# EasyEDA Pro project LisaFPGA Rev 2 EasyEDA Project.epro, schematic LisaFPGA Schematic, sheets 2 to 3 of 8

## Sheets
2 FPGA Programming: Create Date: 2025-10-15; Page Name: FPGA Programming; Update Date: 2026-01-05
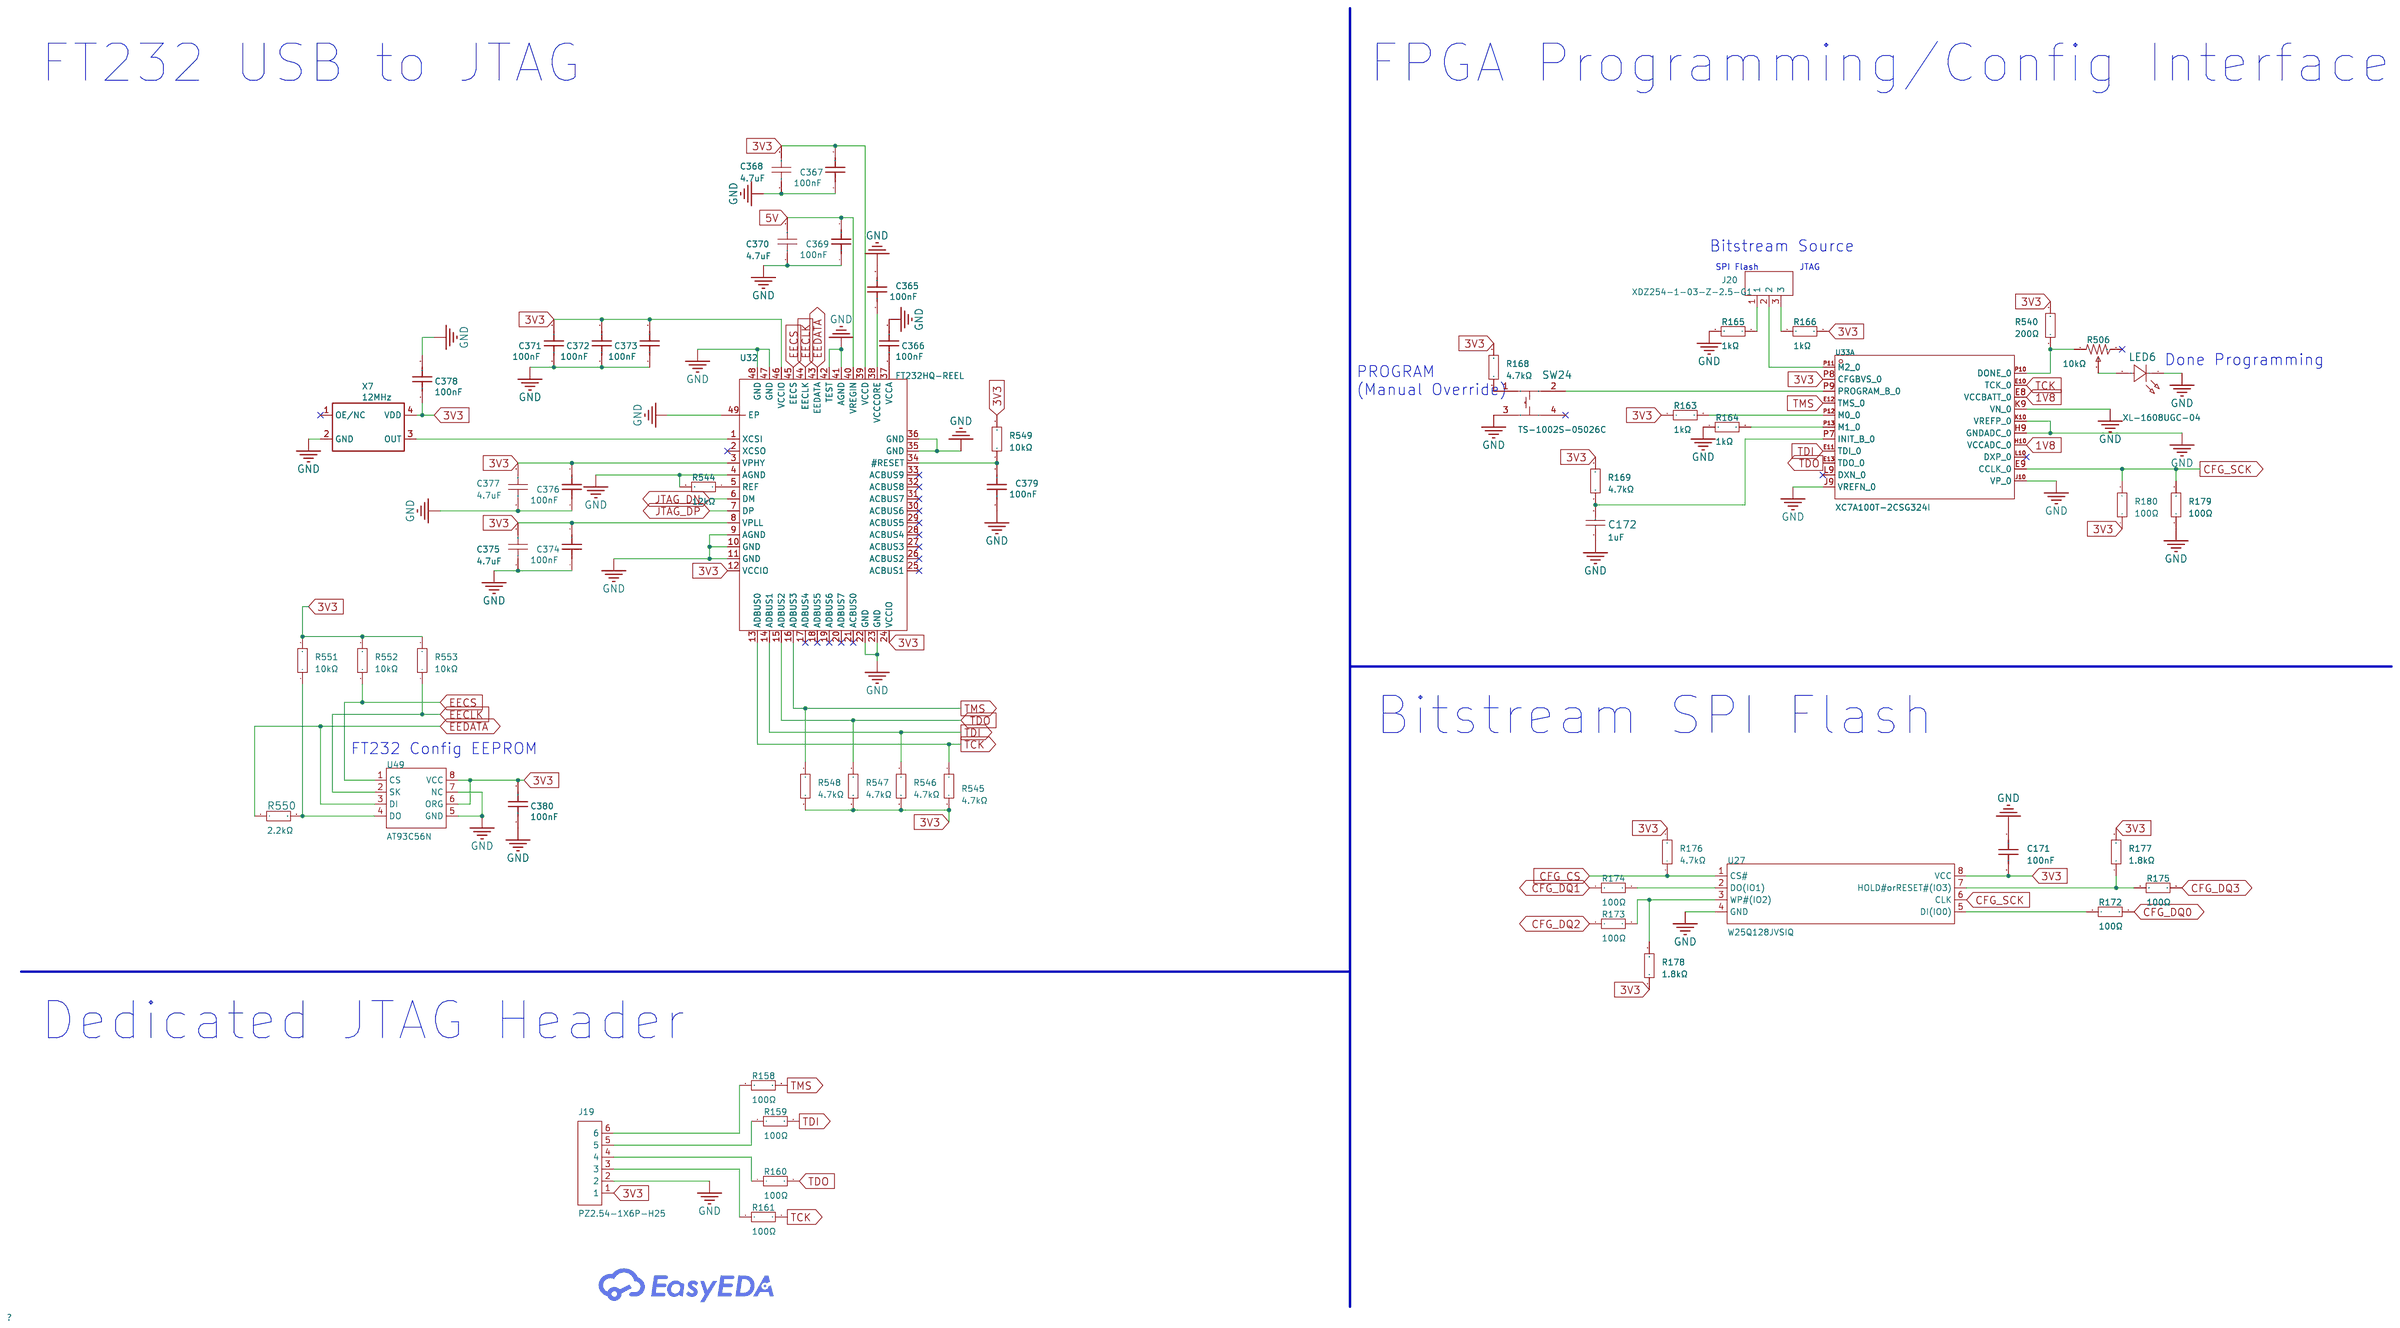
[diagram p2: FPGA Programming]
3 ProFile Interface and SRAM: Create Date: 2025-10-24; Page Name: ProFile Interface and SRAM; Update Date: 2026-01-07
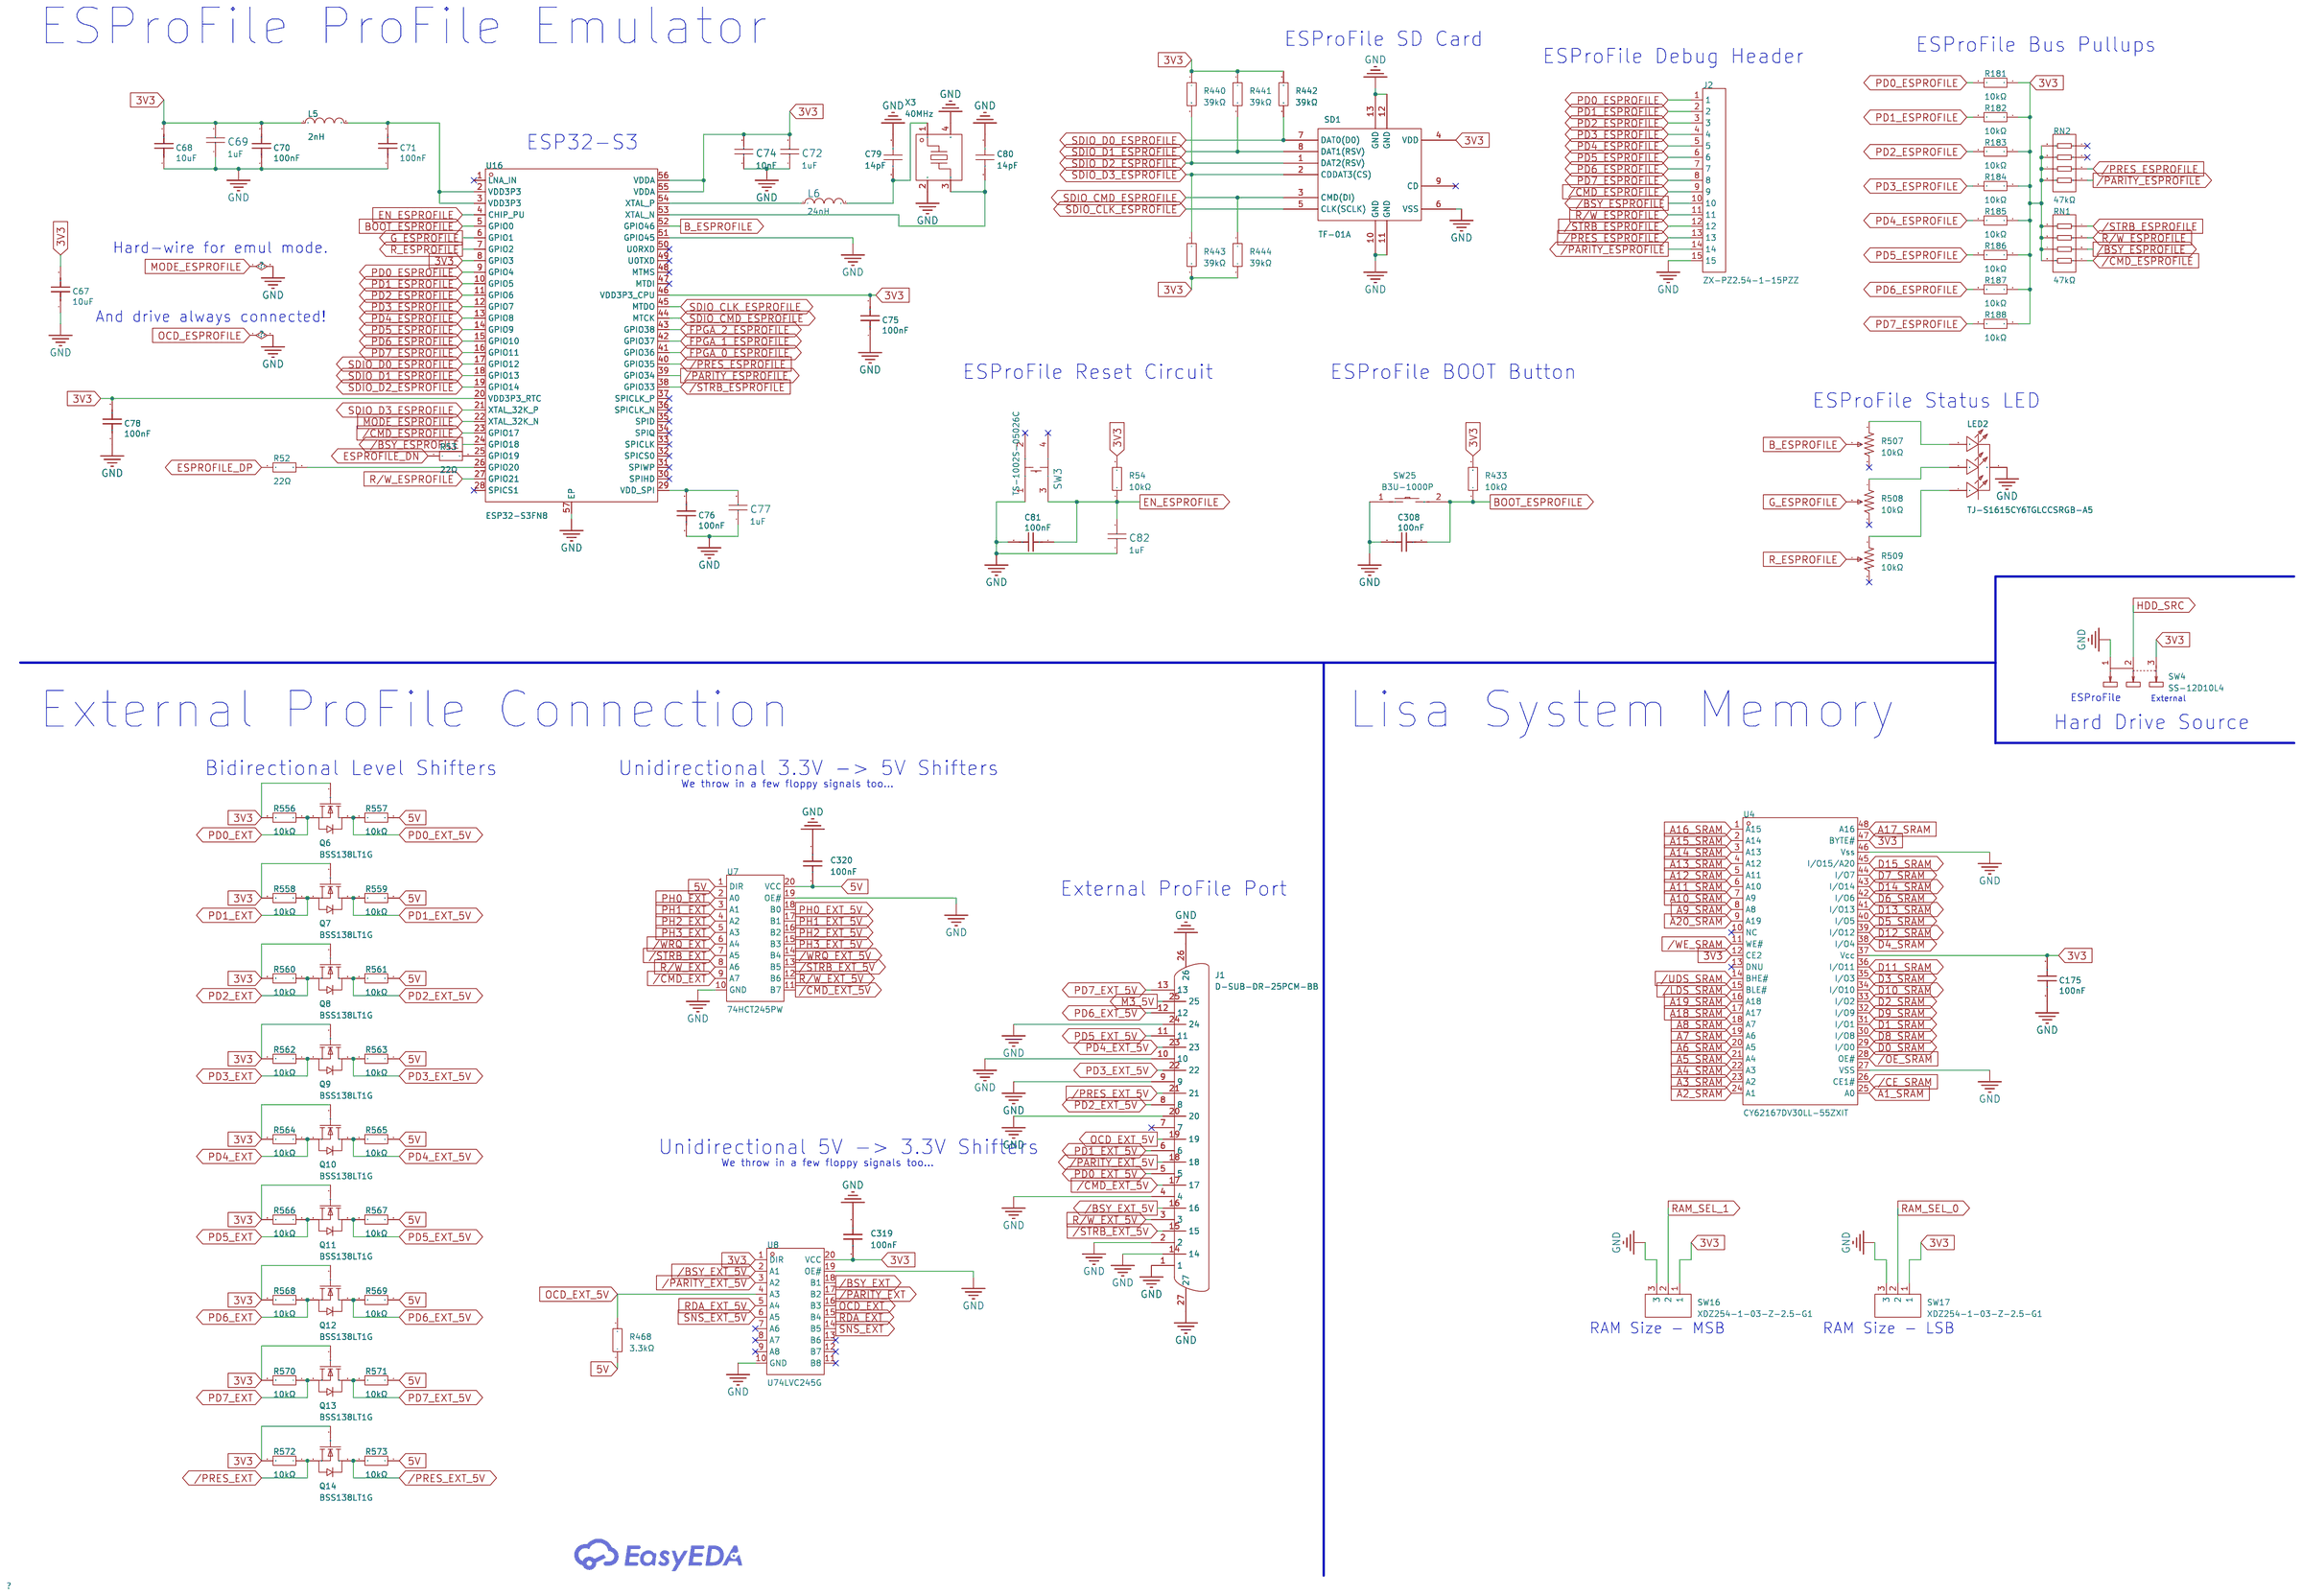
[diagram p3: ProFile Interface and SRAM]

## Parts
sheet FPGA Programming
C171  100nF  [C0402]
C172  1uF  [C0402]
C365  100nF  [C0402]
C366  100nF  [C0402]
C367  100nF  [C0402]
C368  4.7uF  [C0603]
C369  100nF  [C0402]
C370  4.7uF  [C0603]
C371  100nF  [C0402]
C372  100nF  [C0402]
C373  100nF  [C0402]
C374  100nF  [C0402]
C375  4.7uF  [C0603]
C376  100nF  [C0402]
C377  4.7uF  [C0603]
C378  100nF  [C0402]
C379  100nF  [C0402]
C380  100nF  [C0402]
J19  PZ2.54-1X6P-H25  [HDR-TH_6P-P2.54-V-M]
J20  XDZ254-1-03-Z-2.5-G1  [HDR-TH_3P-P2.54-V-M-1]
LED6  XL-1608UGC-04  [LED0603-RD_GREEN]
R158  100Ω  [R0402]
R159  100Ω  [R0402]
R160  100Ω  [R0402]
R161  100Ω  [R0402]
R163  1kΩ  [R0402]
R164  1kΩ  [R0402]
R165  1kΩ  [R0402]
R166  1kΩ  [R0402]
R168  4.7kΩ  [R0402]
R169  4.7kΩ  [R0402]
R172  100Ω  [R0402]
R173  100Ω  [R0402]
R174  100Ω  [R0402]
R175  100Ω  [R0402]
R176  4.7kΩ  [R0402]
R177  1.8kΩ  [R0402]
R178  1.8kΩ  [R0402]
R179  100Ω  [R0402]
R180  100Ω  [R0402]
R506  10kΩ  [RES-ADJ-SMD_3P-L3.0-W3.8-P1.75-BR]
R540  200Ω  [R0402]
R544  12kΩ  [R0603]
R545  4.7kΩ  [R0402]
R546  4.7kΩ  [R0402]
R547  4.7kΩ  [R0402]
R548  4.7kΩ  [R0402]
R549  10kΩ  [R0402]
R550  2.2kΩ  [R0402]
R551  10kΩ  [R0402]
R552  10kΩ  [R0402]
R553  10kΩ  [R0402]
SW24  TS-1002S-05026C  [KEY-SMD_4P-L6.0-W6.0-P4.50-LS9.0]
U27  W25Q128JVSIQ  [SOIC-8_L5.3-W5.3-P1.27-LS8.0-BL]
U32  FT232HQ-REEL  [QFN-48_L8.0-W8.0-P0.50-BL-EP]
U33  XC7A100T-2CSG324I  [BGA-324_L15.0-W15.0-R18-C18-P0.8-TL]  (sections 1,2,3,4)
U49  AT93C56N  [DIP-8_L9.3-W6.4-P2.54-LS7.6-BL]
X7  12MHz  [OSC-SMD_4P-L3.2-W2.5-BL]
sheet ProFile Interface and SRAM
C67  10uF  [C0603]
C68  10uF  [C0603]
C69  1uF  [C0402]
C70  100nF  [C0402]
C71  100nF  [C0402]
C72  1uF  [C0402]
C74  10nF  [C0402]
C75  100nF  [C0402]
C76  100nF  [C0402]
C77  1uF  [C0402]
C78  100nF  [C0402]
C79  14pF  [C0402]
C80  14pF  [C0402]
C81  100nF  [C0402]
C82  1uF  [C0402]
C175  100nF  [C0402]
C308  100nF  [C0402]
C319  100nF  [C0402]
C320  100nF  [C0402]
J1  D-SUB-DR-25PCM-BB  [DB25-TH_D-SUB-DR-25PCM-BB]
J2  ZX-PZ2.54-1-15PZZ  [HDR-TH_15P-P2.54-V-M]
L5  2nH  [L0402-RD]
L6  24nH  [IND-SMD_L1.6-W0.8]
LED2  TJ-S1615CY6TGLCCSRGB-A5  [LED-ARRAY-SMD_4P-L1.6-W1.5-BL-FD]
Q6  BSS138LT1G  [SOT-23-3_L2.9-W1.6-P1.90-LS2.8-BR]
Q7  BSS138LT1G  [SOT-23-3_L2.9-W1.6-P1.90-LS2.8-BR]
Q8  BSS138LT1G  [SOT-23-3_L2.9-W1.6-P1.90-LS2.8-BR]
Q9  BSS138LT1G  [SOT-23-3_L2.9-W1.6-P1.90-LS2.8-BR]
Q10  BSS138LT1G  [SOT-23-3_L2.9-W1.6-P1.90-LS2.8-BR]
Q11  BSS138LT1G  [SOT-23-3_L2.9-W1.6-P1.90-LS2.8-BR]
Q12  BSS138LT1G  [SOT-23-3_L2.9-W1.6-P1.90-LS2.8-BR]
Q13  BSS138LT1G  [SOT-23-3_L2.9-W1.6-P1.90-LS2.8-BR]
Q14  BSS138LT1G  [SOT-23-3_L2.9-W1.6-P1.90-LS2.8-BR]
R52  22Ω  [R0402]
R53  22Ω  [R0402]
R54  10kΩ  [R0402]
R181  10kΩ  [R0402]
R182  10kΩ  [R0402]
R183  10kΩ  [R0402]
R184  10kΩ  [R0402]
R185  10kΩ  [R0402]
R186  10kΩ  [R0402]
R187  10kΩ  [R0402]
R188  10kΩ  [R0402]
R433  10kΩ  [R0402]
R440  39kΩ  [R0402]
R441  39kΩ  [R0402]
R442  39kΩ  [R0402]
R443  39kΩ  [R0402]
R444  39kΩ  [R0402]
R468  3.3kΩ  [R0402]
R507  10kΩ  [RES-ADJ-SMD_3P-L3.0-W3.8-P1.75-BR]
R508  10kΩ  [RES-ADJ-SMD_3P-L3.0-W3.8-P1.75-BR]
R509  10kΩ  [RES-ADJ-SMD_3P-L3.0-W3.8-P1.75-BR]
R556  10kΩ  [R0402]
R557  10kΩ  [R0402]
R558  10kΩ  [R0402]
R559  10kΩ  [R0402]
R560  10kΩ  [R0402]
R561  10kΩ  [R0402]
R562  10kΩ  [R0402]
R563  10kΩ  [R0402]
R564  10kΩ  [R0402]
R565  10kΩ  [R0402]
R566  10kΩ  [R0402]
R567  10kΩ  [R0402]
R568  10kΩ  [R0402]
R569  10kΩ  [R0402]
R570  10kΩ  [R0402]
R571  10kΩ  [R0402]
R572  10kΩ  [R0402]
R573  10kΩ  [R0402]
RN1  47kΩ  [RES-ARRAY-SMD_0603-8P-L3.2-W1.6-BL]
RN2  47kΩ  [RES-ARRAY-SMD_0603-8P-L3.2-W1.6-BL]
SD1  TF-01A  [TF-SMD_TF-01A]
SW3  TS-1002S-05026C  [KEY-SMD_4P-L6.0-W6.0-P4.50-LS9.0]
SW4  SS-12D10L4  [SW-TH_SS-12D10L3]
SW16  XDZ254-1-03-Z-2.5-G1  [HDR-TH_3P-P2.54-V-M-1]
SW17  XDZ254-1-03-Z-2.5-G1  [HDR-TH_3P-P2.54-V-M-1]
SW25  B3U-1000P  [KEY-SMD_B3U-1000PM]
U4  CY62167DV30LL-55ZXIT  [TSOP-48_L18.4-W12.0-P0.50-LS20.0-TL]
U7  74HCT245PW  [TSSOP-20_L6.5-W4.4-P0.65-LS6.4-BL]
U8  U74LVC245G  [TSSOP-20_L6.5-W4.4-P0.65-LS6.4-BL]
U16  ESP32-S3FN8  [QFN-56_L7.0-W7.0-P0.40-TL-EP4.0]
X3  40MHz  [CRYSTAL-SMD_4P-L2.0-W1.6-BL-A]

## Library data of the parts
C70 C71 C75 C76 C78 C81 C171 C175 C308 C319 C320 C365-C367 C369 C371-C374 C376 C378-C380 = 100nF: Supplier: LCSC; Supplier Part: C343042; Manufacturer: TDK; Manufacturer Part: CGA2B3X7R1H104KT0Y0F; JLCPCB Part Class: Extended Part; nameAlias: Value; Contributor: LCSC; spicePre: C; spiceSymbolName: CGA2B3X7R1H104KT0Y0F
C69 C72 C77 C82 C172 = CL05A105KO5NNNC: Capacitance:1uF Tolerance:±10% Tolerance:±10% Voltage Rating:16V Temperature Coefficient:X5R; LCSC Part Name: 1uF ±10% 16V; Supplier Part: C29266; Manufacturer: SAMSUNG(三星); Supplier Footprint: 0402; JLCPCB Part Class: Extended Part; Datasheet: https://item.szlcsc.com/datasheet/CL05A105KO5NNNC/30018.html; Supplier: LCSC; Tolerance: ±10%; Voltage Rating: 16V; Temperature Coefficient: X5R
C368 C370 C375 C377 = CL10A475KO8NNNC: Capacitance:4.7uF Tolerance:±10% Tolerance:±10% Voltage Rating:16V Temperature Coefficient:X5R; LCSC Part Name: 4.7uF ±10% 16V; Supplier Part: C19666; Manufacturer: SAMSUNG(三星); Supplier Footprint: 0603; JLCPCB Part Class: Basic Part; Datasheet: https://item.szlcsc.com/datasheet/CL10A475KO8NNNC/20375.html; Supplier: LCSC; Tolerance: ±10%; Voltage Rating: 16V; Temperature Coefficient: X5R
J19 = PZ2.54-1X6P-H25: Pin Structure:1x6P Pitch:2.54mm Row Spacing:- Circluar Pins/Square Pins:Pin Header Mounting Type:Through Hole Number of Rows:1 Number of Pins:6P Current Rating:3A Voltage Rating (Max):- Length of Mating Pin:6mm Insulation Height:2.5mm Length of End Connec; LCSC Part Name: 1x6P 间距:2.54mm 方针 直插; Supplier Part: C42431790; Manufacturer: JXTCONN(聚兴泰); Supplier Footprint: 插件,P=2.54mm; JLCPCB Part Class: Extended Part; Datasheet: https://item.szlcsc.com/datasheet/PZ2.54-1X6P-H25/44458920.html; Supplier: LCSC; Pin Structure: 1x6P; Pitch: 2.54mm; Circluar Pins/Square Pins: Pin Header; Mounting Type: Through Hole; Number of Rows: 1; Number of Pins: 6P; Current Rating: 3A; Length of Mating Pin: 6mm; Insulation Height: 2.5mm; Length of End Connection Pin: 3mm; Contact Material: Brass; Contact Plating: Gold; Operating Temperature: -40℃~+105℃; Color: Black
J20 SW16 SW17 = XDZ254-1-03-Z-2.5-G1: Pin Structure:1x3P Pitch:2.54mm Circluar Pins/Square Pins:Pin Header Mounting Type:Through Hole Number of Rows:1 Number of Pins:3P Current Rating:3A Length of Mating Pin:6mm Insulation Height:2.5mm Length of End Connection Pin:3mm Operating Temperature:-4; LCSC Part Name: 1x3P 间距:2.54mm 方针 直插; Supplier Part: C18905844; Manufacturer: XUNDA(讯答); Supplier Footprint: 插件,P=2.54mm; JLCPCB Part Class: Extended Part; Datasheet: https://item.szlcsc.com/datasheet/XDZ254-1-03-Z-2.5-G1/20100548.html; Supplier: LCSC; Pin Structure: 1x3P; Pitch: 2.54mm; Circluar Pins/Square Pins: Pin Header; Mounting Type: Through Hole; Number of Rows: 1; Number of Pins: 3P; Current Rating: 3A; Length of Mating Pin: 6mm; Insulation Height: 2.5mm; Length of End Connection Pin: 3mm; Operating Temperature: -40℃~+105℃; Color: Black
LED6 = XL-1608UGC-04: Lamp Holder Type:- Illumination Color:Emerald Green Voltage - Forward(Vf):3.3V Voltage - Forward(Vf):3.3V Power(Watts):70mW Forward Current:20mA Wavelength - Dominant:515nm~535nm Wavelength - Dominant:515nm~535nm Peak Wavelength:525nm Diode Configuration:; Supplier Part: C965804; Manufacturer: XINGLIGHT(成兴光); Supplier Footprint: 0603; JLCPCB Part Class: Extended Part; Datasheet: https://item.szlcsc.com/datasheet/XL-1608UGC-04/1051413.html; Supplier: LCSC; Illumination Color: Emerald Green; Voltage - Forward(Vf): 3.3V; Power(Watts): 70mW; Forward Current: 20mA; Wavelength - Dominant: 515nm~535nm; Peak Wavelength: 525nm; Diode Configuration: Discrete Diode; Lens Color: Water Clear; Luminous Intensity: 810mcd; Viewing Angle: 120°; Mounting Style: op View Mount
R158-R161 R172-R175 R179 R180 = RC0402FR-07100RL: Type:Thick Film Resistor Resistance:100Ω Tolerance:±1% Tolerance:±1% Power(Watts):62.5mW Voltage-Supply(Max):50V Temperature Coefficient:±100ppm/℃ Temperature Coefficient:±100ppm/℃ Operating Temperature:-55℃~+155℃ Operating Temperature:-55℃~+155℃; LCSC Part Name: 厚膜电阻 100Ω ±1% 62.5mW; Supplier Part: C106232; Manufacturer: YAGEO(国巨); Supplier Footprint: 0402; JLCPCB Part Class: Extended Part; Datasheet: https://item.szlcsc.com/datasheet/RC0402FR-07100RL/107447.html; Supplier: LCSC; Type: Thick Film Resistor; Tolerance: ±1%; Power(Watts): 62.5mW; Voltage-Supply(Max): 50V; Temperature Coefficient: ±100ppm/℃; Operating Temperature: -55℃~+155℃
R163-R166 = RC0402FR-071KL: Type:Thick Film Resistors Resistance: Tolerance:±1% Tolerance:±1% Power(Watts): Overload Voltage (Max): Temperature Coefficient:±100ppm/℃ Temperature Coefficient:±100ppm/℃ Operating Temperature Range:-55℃~+155℃ Operating Temperature Range:-55℃~+155℃; LCSC Part Name: 厚膜电阻 1kΩ ±1% 62.5mW; Supplier Part: C106235; Manufacturer: YAGEO(国巨); Supplier Footprint: 0402; JLCPCB Part Class: Extended Part; Datasheet: https://atta.szlcsc.com/upload/public/pdf/source/20180927/C295883_E8D83085EA81BD7DE0B2B681138C15EE.pdf; Supplier: LCSC; Type: Thick Film Resistors; Tolerance: ±1%; Temperature Coefficient: ±100ppm/℃; Operating Temperature Range: -55℃~+155℃
R168 R169 R176 R545-R548 = RC0402FR-074K7L: Type:Thick Film Resistor Resistance:4.7kΩ Tolerance:±1% Tolerance:±1% Power(Watts):62.5mW Voltage-Supply(Max):50V Temperature Coefficient:±100ppm/℃ Temperature Coefficient:±100ppm/℃ Operating Temperature:-55℃~+155℃ Operating Temperature:-55℃~+155℃; LCSC Part Name: 厚膜电阻 4.7kΩ ±1% 62.5mW; Supplier Part: C105871; Manufacturer: YAGEO(国巨); Supplier Footprint: 0402; JLCPCB Part Class: Extended Part; Datasheet: https://item.szlcsc.com/datasheet/RC0402FR-074K7L/107086.html; Supplier: LCSC; Type: Thick Film Resistor; Tolerance: ±1%; Power(Watts): 62.5mW; Voltage-Supply(Max): 50V; Temperature Coefficient: ±100ppm/℃; Operating Temperature: -55℃~+155℃
R177 R178 = WR04X182JTL: Type:Thick Film Resistor Resistance:1.8kΩ Tolerance:±5% Tolerance:±5% Power(Watts):62.5mW Voltage-Supply(Max):50V Temperature Coefficient:±100ppm/℃ Temperature Coefficient:±100ppm/℃ Operating Temperature:-55℃~+155℃ Operating Temperature:-55℃~+155℃; LCSC Part Name: 厚膜电阻 1.8kΩ ±5% 62.5mW; Supplier Part: C170383; Manufacturer: Walsin(华新科); Supplier Footprint: 0402; JLCPCB Part Class: Extended Part; Datasheet: https://atta.szlcsc.com/upload/public/pdf/source/20191217/C470037_D99261402F77DA8B1D609223749D445A.pdf; Supplier: LCSC; Type: Thick Film Resistor; Tolerance: ±5%; Power(Watts): 62.5mW; Voltage-Supply(Max): 50V; Temperature Coefficient: ±100ppm/℃; Operating Temperature: -55℃~+155℃
R506-R509 = TC33X-2-103E: Resistance:10kΩ Tolerance:±25% Tolerance:±25% Voltage Rating:- Power(Watts):150mW Temperature Coefficient:±250ppm/℃ Temperature Coefficient:±250ppm/℃ Number of Turns:; LCSC Part Name: 10kΩ ±25%; Supplier Part: C719176; Manufacturer: BOURNS; Supplier Footprint: SMD-3P,3.8x3.6mm; JLCPCB Part Class: Extended Part; Datasheet: https://item.szlcsc.com/datasheet/TC33X-2-103E/762158.html; Supplier: LCSC; Tolerance: ±25%; Power(Watts): 150mW; Temperature Coefficient: ±250ppm/℃
R540 = RC0402FR-07200RL: Type:Thick Film Resistor Resistance:200Ω Tolerance:±1% Tolerance:±1% Power(Watts):62.5mW Voltage-Supply(Max):50V Temperature Coefficient:±100ppm/℃ Temperature Coefficient:±100ppm/℃ Operating Temperature:-55℃~+155℃ Operating Temperature:-55℃~+155℃; LCSC Part Name: 厚膜电阻 200Ω ±1% 62.5mW; Supplier Part: C114764; Manufacturer: YAGEO(国巨); Supplier Footprint: 0402; JLCPCB Part Class: Extended Part; Datasheet: https://item.szlcsc.com/datasheet/RC0402FR-07200RL/116008.html; Supplier: LCSC; Type: Thick Film Resistor; Tolerance: ±1%; Power(Watts): 62.5mW; Voltage-Supply(Max): 50V; Temperature Coefficient: ±100ppm/℃; Operating Temperature: -55℃~+155℃
R544 = RC0603FR-0712KL: Type:Thick Film Resistor Resistance:12kΩ Tolerance:±1% Tolerance:±1% Power(Watts):100mW Voltage-Supply(Max):75V Temperature Coefficient:±100ppm/℃ Temperature Coefficient:±100ppm/℃ Operating Temperature:-55℃~+155℃ Operating Temperature:-55℃~+155℃; LCSC Part Name: 厚膜电阻 12kΩ ±1% 100mW; Supplier Part: C114659; Manufacturer: YAGEO(国巨); Supplier Footprint: 0603; JLCPCB Part Class: Extended Part; Datasheet: https://item.szlcsc.com/datasheet/RC0603FR-0712KL/115903.html; Supplier: LCSC; Type: Thick Film Resistor; Tolerance: ±1%; Power(Watts): 100mW; Voltage-Supply(Max): 75V; Temperature Coefficient: ±100ppm/℃; Operating Temperature: -55℃~+155℃
R54 R181-R188 R433 R549 R551-R553 R556-R573 = RC0402FR-0710KL: Type:Thick Film Resistor Resistance:10kΩ Tolerance:±1% Tolerance:±1% Power(Watts):62.5mW Voltage-Supply(Max):50V Temperature Coefficient:±100ppm/℃ Temperature Coefficient:±100ppm/℃ Operating Temperature:-55℃~+155℃ Operating Temperature:-55℃~+155℃; LCSC Part Name: 厚膜电阻 10kΩ ±1% 62.5mW; Supplier Part: C60490; Manufacturer: YAGEO(国巨); Supplier Footprint: 0402; JLCPCB Part Class: Extended Part; Datasheet: https://item.szlcsc.com/datasheet/RC0402FR-0710KL/61542.html; Supplier: LCSC; Type: Thick Film Resistor; Tolerance: ±1%; Power(Watts): 62.5mW; Voltage-Supply(Max): 50V; Temperature Coefficient: ±100ppm/℃; Operating Temperature: -55℃~+155℃
R550 = 0402WGF2201TCE: Type:Thick Film Resistor Resistance:2.2kΩ Tolerance:±1% Tolerance:±1% Power(Watts):62.5mW Voltage-Supply(Max):50V Temperature Coefficient:±100ppm/℃ Temperature Coefficient:±100ppm/℃ Operating Temperature:-55℃~+155℃ Operating Temperature:-55℃~+155℃; LCSC Part Name: 2.2kΩ ±1% 62.5mW 厚膜电阻; Supplier Part: C25879; Manufacturer: UNI-ROYAL(厚声); Supplier Footprint: 0402; JLCPCB Part Class: Basic Part; Datasheet: https://item.szlcsc.com/datasheet/0402WGF2201TCE/26622.html; Supplier: LCSC; Type: Thick Film Resistor; Tolerance: ±1%; Power(Watts): 62.5mW; Voltage-Supply(Max): 50V; Temperature Coefficient: ±100ppm/℃; Operating Temperature: -55℃~+155℃
SW3 SW24 = TS-1002S-05026C: Circuit:SPST Actuator Style:Round Button Mounting Type:Surface Mount,Vertical Length:6mm Width:6mm Switch Height:5mm Contact Current:50mA Voltage Rating:12V With Lamp:- Life:-; LCSC Part Name: 6*6*5mm 立贴 轻触开关; Supplier Part: C455110; Manufacturer: XUNPU(讯普); Supplier Footprint: SMD-4P,6x6mm; JLCPCB Part Class: Extended Part; Datasheet: https://item.szlcsc.com/datasheet/TS-1002S-05026C/457515.html; Supplier: LCSC; Circuit: SPST; Actuator Style: Round Button; Mounting Type: Surface Mount,Vertical; Length: 6mm; Width: 6mm; Switch Height: 5mm; Contact Current: 50mA; Voltage Rating: 12V
U27 = W25Q128JVSIQ_C113767: Interface:SPI Memory Size:- Clock Frequency:133MHz Voltage - Supply:2.7V~3.6V Voltage - Supply:2.7V~3.6V Program / Erase Cycles:100,000 Cycles Page Programming Time (Tpp):3ms Operating Temperature:- Operating Temperature:-; LCSC Part Name: 支持双路/四路SPI接口的3V、128Mbit 串行闪存; Supplier Part: C113767; Manufacturer: Winbond(华邦); Supplier Footprint: SOIC-8-208mil; JLCPCB Part Class: Extended Part; Datasheet: https://item.szlcsc.com/datasheet/W25Q128JVSIQ/115003.html; Supplier: LCSC; Interface: SPI; Clock Frequency: 133MHz; Voltage - Supply: 2.7V~3.6V; Program / Erase Cycles: 100,000 Cycles; Page Programming Time (Tpp): 3ms
U32 = FT232HQ-REEL: Applications Function:USB to UART；USB to FIFO USB Protocol:- Voltage - Supply:2.97V~3.63V；1.62V~1.98V Voltage - Supply:2.97V~3.63V；1.62V~1.98V Operating Temperature:-40℃~+85℃ Operating Temperature:-40℃~+85℃; LCSC Part Name: FT232H 单通道高速USB转多功能UART/FIFO IC; Supplier Part: C82158; Manufacturer: FTDI(飞特帝亚); Supplier Footprint: QFN-48-EP(8x8); JLCPCB Part Class: Extended Part; Datasheet: https://item.szlcsc.com/datasheet/FT232HQ-REEL/83313.html; Supplier: LCSC; Applications Function: USB to UART；USB to FIFO; Voltage - Supply: 2.97V~3.63V；1.62V~1.98V; Operating Temperature: -40℃~+85℃
U33 = XC7A100T-2CSG324I: LCSC Part Name: XC7A100T 2CSG324I -; Supplier Part: C1521791; Manufacturer: XILINX(赛灵思); Supplier Footprint: CSPBGA-324; JLCPCB Part Class: Extended Part; Supplier: LCSC
U49 = AT93C56N: Interface:SPI Memory Size:2Kbit Clock Frequency:2MHz Clock Frequency:2MHz Voltage - Supply:1.8V~5.5V Voltage - Supply:1.8V~5.5V Write Cycle Time(Tw):10ms Data Retention - TDR (Year):100 Years Write Cycle Endurance:1,000,000 cycles Operating Temperature:-4; LCSC Part Name: 3线串行EEPROM; Supplier Part: C434598; Manufacturer: HGSEMI(华冠); Supplier Footprint: DIP-8; JLCPCB Part Class: Extended Part; Datasheet: https://item.szlcsc.com/datasheet/AT93C56N/431691.html; Supplier: LCSC; Interface: SPI; Memory Size: 2Kbit; Clock Frequency: 2MHz; Voltage - Supply: 1.8V~5.5V; Write Cycle Time(Tw): 10ms; Data Retention - TDR (Year): 100 Years; Write Cycle Endurance: 1,000,000 cycles; Operating Temperature: -40℃~+85℃
X7 = 12MHz: Supplier: LCSC; Supplier Part: C725989; Manufacturer: YXC(扬兴晶振); Manufacturer Part: OT322512MJBA4SL; JLCPCB Part Class: Extended Part; Contributor: lcsc; nameAlias: Value; spicePre: X; spiceSymbolName: OT322512MJBA4SL
C67 C68 = 10uF: Supplier: LCSC; Supplier Part: C2936601; Manufacturer: YAGEO(国巨); Manufacturer Part: CC0603KRX5R7BB106; JLCPCB Part Class: Extended Part; nameAlias: Value; Contributor: lcsc; spicePre: C; spiceSymbolName: CC0603KRX5R7BB106
C74 = CC0402KRX7R9BB103: Capacitance:10nF Tolerance:±10% Tolerance:±10% Voltage Rating:50V Temperature Coefficient:X7R; LCSC Part Name: 10nF ±10% 50V; Supplier Part: C60133; Manufacturer: YAGEO(国巨); Supplier Footprint: 0402; JLCPCB Part Class: Extended Part; Datasheet: https://item.szlcsc.com/datasheet/CC0402KRX7R9BB103/61185.html; Supplier: LCSC; Tolerance: ±10%; Voltage Rating: 50V; Temperature Coefficient: X7R
C79 C80 = 0402N140J500CT: Capacitance:14pF Tolerance:±5% Tolerance:±5% Voltage Rating:50V Temperature Coefficient:NP0; LCSC Part Name: 14pF ±5% 50V; Supplier Part: C458857; Manufacturer: Walsin(华新科); Supplier Footprint: 0402; JLCPCB Part Class: Extended Part; Datasheet: https://item.szlcsc.com/datasheet/0402N140J500CT/462940.html; Supplier: LCSC; Tolerance: ±5%; Voltage Rating: 50V; Temperature Coefficient: NP0
J1 = D-SUB-DR-25PCM-BB: Gender:Female Number of Pins:25P Mounting Type:Right Angle Number of Rows:2 Current Rating-Signal:3A Color:Black Operating Temperature:-50℃~+105℃ Operating Temperature:-50℃~+105℃; LCSC Part Name: 母 P数:25P; Supplier Part: C19077339; Manufacturer: XUNPU(讯普); Supplier Footprint: 弯插; JLCPCB Part Class: Extended Part; Datasheet: https://item.szlcsc.com/datasheet/D-SUB-DR-25PCM-BB/20275083.html; Supplier: LCSC; Gender: Female; Number of Pins: 25P; Mounting Type: Right Angle; Number of Rows: 2; Current Rating-Signal: 3A; Color: Black; Operating Temperature: -50℃~+105℃
J2 = ZX-PZ2.54-1-15PZZ: Pin Structure:1x15P Pitch:2.54mm Row Spacing:- Circluar Pins/Square Pins:Pin Header Mounting Type:Through Hole Number of Rows:1 Number of Pins:15P Current Rating:3A Voltage Rating (Max):- Length of Mating Pin:6mm Insulation Height:2.5mm Length of End Conn; LCSC Part Name: 1x15P 间距:2.54mm 方针 直插; Supplier Part: C7501269; Manufacturer: Megastar(兆星); Supplier Footprint: 插件,P=2.54mm; JLCPCB Part Class: Extended Part; Datasheet: https://item.szlcsc.com/datasheet/ZX-PZ2.54-1-15PZZ/8582482.html; Supplier: LCSC; Pin Structure: 1x15P; Pitch: 2.54mm; Circluar Pins/Square Pins: Pin Header; Mounting Type: Through Hole; Number of Rows: 1; Number of Pins: 15P; Current Rating: 3A; Length of Mating Pin: 6mm; Insulation Height: 2.5mm; Length of End Connection Pin: 3mm; Contact Material: Brass; Contact Plating: Gold; Operating Temperature: -40℃~+105℃; Color: Black
L5 = MLG1005S2N0ST000: Inductance: Tolerance:- Tolerance:- Current Rating: Current - Saturation (Isat):- DC Resistance(DCR): Q @ Frequency:7@100MHz Frequency - Self Resonant: Ratings:; LCSC Part Name: ±0.3nH 2nH; Supplier Part: C98757; Manufacturer: TDK; Supplier Footprint: 0402; JLCPCB Part Class: Extended Part; Datasheet: https://atta.szlcsc.com/upload/public/pdf/source/20180928/C275290_71FD5C0A90A4E94260814ECBF3BC6ADD.pdf; Supplier: LCSC; Q @ Frequency: 7@100MHz
L6 = LQW18AN24NG00D: Inductance:24nH Tolerance:±2% Tolerance:±2% Current Rating:500mA Current - Saturation(Isat):- DC Resistance(DCR):210mΩ Ratings:-; LCSC Part Name: 24nH ±2%; Supplier Part: C162644; Manufacturer: muRata(村田); Supplier Footprint: 0603; JLCPCB Part Class: Extended Part; Datasheet: https://item.szlcsc.com/datasheet/LQW18AN24NG00D/174025.html; Supplier: LCSC; Tolerance: ±2%; Current Rating: 500mA; DC Resistance(DCR): 210mΩ
LED2 = TJ-S1615CY6TGLCCSRGB-A5: Diode Configuration:Common Cathode Luminous Intensity:G:300mcd~800mcd；B:60mcd~200mcd；R:60mcd~200mcd Viewing Angle:120° Lens Color:Water Clear Installation Method:op View Mount Operating Temperature:-40℃~+80℃ Operating Temperature:-40℃~+80℃; LCSC Part Name: RGB三色; Supplier Part: C601684; Manufacturer: TOGIALED(统佳); Supplier Footprint: SMD-4P,1.6x1.5mm; JLCPCB Part Class: Extended Part; Datasheet: https://item.szlcsc.com/datasheet/TJ-S1615CY6TGLCCSRGB-A5/631042.html; Supplier: LCSC; Diode Configuration: Common Cathode; Luminous Intensity: G:300mcd~800mcd；B:60mcd~200mcd；R:60mcd~200mcd; Viewing Angle: 120°; Lens Color: Water Clear; Installation Method: op View Mount; Operating Temperature: -40℃~+80℃
Q6-Q14 = BSS138LT1G: Number:1 N-Channel Drain to Source Voltage:50V Current - Continuous Drain(Id):200mA RDS(on):5.6Ω@2.75V Pd - Power Dissipation:225mW Gate Threshold Voltage (Vgs(th)):500mV Input Capacitance(Ciss):50pF@25V Reverse Transfer Capacitance (Crss@Vds):5pF@25V Ope; LCSC Part Name: 1个N沟道 耐压:50V 电流:200mA; Supplier Part: C82045; Manufacturer: onsemi(安森美); Supplier Footprint: SOT-23; JLCPCB Part Class: Extended Part; Datasheet: https://item.szlcsc.com/datasheet/BSS138LT1G/83200.html; Supplier: LCSC; Number: 1 N-Channel; Drain to Source Voltage: 50V; Current - Continuous Drain(Id): 200mA; RDS(on): 5.6Ω@2.75V; Pd - Power Dissipation: 225mW; Gate Threshold Voltage (Vgs(th)): 500mV; Input Capacitance(Ciss): 50pF@25V; Reverse Transfer Capacitance (Crss@Vds): 5pF@25V; Operating Temperature: -55℃~+150℃
R52 R53 = RC0402FR-0722RL: Type:Thick Film Resistors Resistance: Tolerance:±1% Tolerance:±1% Power(Watts): Overload Voltage (Max): Temperature Coefficient:±100ppm/℃ Temperature Coefficient:±100ppm/℃ Operating Temperature Range:-55℃~+155℃ Operating Temperature Range:-55℃~+155℃; LCSC Part Name: 厚膜电阻 22Ω ±1% 62.5mW; Supplier Part: C114765; Manufacturer: YAGEO(国巨); Supplier Footprint: 0402; JLCPCB Part Class: Extended Part; Datasheet: https://atta.szlcsc.com/upload/public/pdf/source/20180821/C275644_0D56F95EFF785E7D9A1FEF436B37DA78.pdf; Supplier: LCSC; Type: Thick Film Resistors; Tolerance: ±1%; Temperature Coefficient: ±100ppm/℃; Operating Temperature Range: -55℃~+155℃
R440-R444 = 0402WGF3902TCE: Type:Thick Film Resistor Resistance:39kΩ Tolerance:±1% Tolerance:±1% Power(Watts):62.5mW Voltage-Supply(Max):50V Temperature Coefficient:±100ppm/℃ Temperature Coefficient:±100ppm/℃ Operating Temperature:-55℃~+155℃ Operating Temperature:-55℃~+155℃; LCSC Part Name: 39kΩ ±1% 62.5mW 厚膜电阻; Supplier Part: C25783; Manufacturer: UNI-ROYAL(厚声); Supplier Footprint: 0402; JLCPCB Part Class: Extended Part; Datasheet: https://item.szlcsc.com/datasheet/0402WGF3902TCE/26526.html; Supplier: LCSC; Type: Thick Film Resistor; Tolerance: ±1%; Power(Watts): 62.5mW; Voltage-Supply(Max): 50V; Temperature Coefficient: ±100ppm/℃; Operating Temperature: -55℃~+155℃
R468 = RC0402FR-073K3L: Type:Thick Film Resistor Resistance:3.3kΩ Tolerance:±1% Tolerance:±1% Power(Watts):62.5mW Voltage-Supply(Max):50V Temperature Coefficient:±100ppm/℃ Temperature Coefficient:±100ppm/℃ Operating Temperature:-55℃~+155℃ Operating Temperature:-55℃~+155℃; LCSC Part Name: 厚膜电阻 3.3kΩ ±1% 62.5mW; Supplier Part: C137992; Manufacturer: YAGEO(国巨); Supplier Footprint: 0402; JLCPCB Part Class: Extended Part; Datasheet: https://item.szlcsc.com/datasheet/RC0402FR-073K3L/149308.html; Supplier: LCSC; Type: Thick Film Resistor; Tolerance: ±1%; Power(Watts): 62.5mW; Voltage-Supply(Max): 50V; Temperature Coefficient: ±100ppm/℃; Operating Temperature: -55℃~+155℃
RN1 RN2 = TC164-FR-0747KL: Number of Resistors: Resistance: Tolerance:±1% Tolerance:±1% Power(Watts): Temperature Coefficient:±200ppm/℃ Temperature Coefficient:±200ppm/℃ Number of Pins:; LCSC Part Name: 47kΩ ±1%; Supplier Part: C872229; Manufacturer: YAGEO(国巨); Supplier Footprint: 0603x4; JLCPCB Part Class: Extended Part; Datasheet: https://atta.szlcsc.com/upload/public/pdf/source/20211215/4FD9DBAA641461C0158FF8BE819EB67E.pdf; Supplier: LCSC; Tolerance: ±1%; Temperature Coefficient: ±200ppm/℃
SD1 = TF-01A_C91145: Card Connection Mode:Push-Push Card Type:MicroSD Card (TF Card) Connector Type:Connector and Ejector Additional Card Detection Pins:- Supplementary Features:With Locating Post Height Above Board:1.85mm Operating Temperature:- Operating Temperature:-; LCSC Part Name: 自弹式 MicroSD卡(TF卡) 卡座; Supplier Part: C91145; Manufacturer: 韩国韩荣; Supplier Footprint: SMD; JLCPCB Part Class: Extended Part; Datasheet: https://item.szlcsc.com/datasheet/TF-01A/92334.html; Supplier: LCSC; Card Connection Mode: Push-Push; Card Type: MicroSD Card (TF Card); Connector Type: Connector and Ejector; Supplementary Features: With Locating Post; Height Above Board: 1.85mm
SW4 = SS-12D10L4: Circuit:SPDT Actuator Style:Rectangular Columnar Termination Style:PC Pin Length:13mm Width:6.8mm Switch Height:6.4mm Mounting Type:Through Hole Actuator Color:Black Current Rating:3A Voltage Rating:125V Life:10,000 Cycles Operating Temperature:-40℃~+85℃; LCSC Part Name: 柄长4mm 直插双档 滑动开关; Supplier Part: C843364; Manufacturer: XKB Connection(中国星坤); Supplier Footprint: 插件,13x6.8mm; JLCPCB Part Class: Extended Part; Datasheet: https://item.szlcsc.com/datasheet/SS-12D10L4/902366.html; Supplier: LCSC; Circuit: SPDT; Actuator Style: Rectangular Columnar; Termination Style: PC Pin; Length: 13mm; Width: 6.8mm; Switch Height: 6.4mm; Mounting Type: Through Hole; Actuator Color: Black; Current Rating: 3A; Voltage Rating: 125V; Life: 10,000 Cycles; Operating Temperature: -40℃~+85℃
SW25 = B3U-1000P_C231329: Circuit:SPST Actuator Style:Round Button Operating Force:1.53N Mounting Type:Surface Mount,Vertical Length:3mm Width:2.5mm Switch Height:1.6mm Contact Current:50mA Voltage Rating:12V With Lamp:- Termination Style:SMD(SMT) Tab Life:- Operating Temperature:; LCSC Part Name: 3*2.5*1.6mm 立贴 轻触开关; Supplier Part: C231329; Manufacturer: OMRON(欧姆龙); Supplier Footprint: SMD,2.5x3mm; JLCPCB Part Class: Extended Part; Datasheet: https://item.szlcsc.com/datasheet/B3U-1000P/231216.html; Supplier: LCSC; Circuit: SPST; Actuator Style: Round Button; Operating Force: 1.53N; Mounting Type: Surface Mount,Vertical; Length: 3mm; Width: 2.5mm; Switch Height: 1.6mm; Contact Current: 50mA; Voltage Rating: 12V; Termination Style: SMD(SMT) Tab; Operating Temperature: -25℃~+70℃
U4 = CY62167DV30LL-55ZXIT_C2956479: Interface:Parallel Memory Size:16Mbit Voltage - Supply:2.2V~3.6V Voltage - Supply:2.2V~3.6V Access Time:- Operating Temperature:-40℃~+85℃ Operating Temperature:-40℃~+85℃; Supplier Part: C2956479; Manufacturer: Infineon/CYPRESS(赛普拉斯); Supplier Footprint: TSOP-48; JLCPCB Part Class: Extended Part; Datasheet: https://atta.szlcsc.com/upload/public/pdf/source/20220810/485070C85B65368BE83E53161FF402F7.pdf; Supplier: LCSC; Interface: Parallel; Memory Size: 16Mbit; Voltage - Supply: 2.2V~3.6V; Operating Temperature: -40℃~+85℃
U7 = 74HCT245PW: Supplier Part: C52140501; Manufacturer: MDD(辰达半导体); Supplier Footprint: TSSOP-20L; JLCPCB Part Class: Extended Part; Datasheet: https://item.szlcsc.com/datasheet/74HCT245PW/54938180.html; Supplier: LCSC
U8 = U74LVC245G: Supplier Part: C7494910; Manufacturer: UTC(友顺); Supplier Footprint: TSSOP-20; JLCPCB Part Class: Extended Part; Datasheet: https://item.szlcsc.com/datasheet/U74LVC245G/8557814.html; Supplier: LCSC
U16 = ESP32-S3FN8: Supplier Part: C2913196; Manufacturer: ESPRESSIF(乐鑫); Supplier Footprint: QFN-56-EP(7x7); JLCPCB Part Class: Extended Part; Datasheet: https://item.szlcsc.com/datasheet/ESP32-S3FN8/3198294.html; Supplier: LCSC
X3 = XTM20040000FT00351001: Type:Crystal Oscillator Frequency:40MHz Normal temperature Frequency Tolerance:±10ppm Normal temperature Frequency Tolerance:±10ppm Load Capacitance:9pF Frequency Stability:±10ppm Frequency Stability:±10ppm Equivalent Series Resistance(ESR):40Ω Operating; LCSC Part Name: 40MHz 4P 2016 9pF ±10ppm -20~70℃（±10ppm）; Supplier Part: C37635335; Manufacturer: 同晶; Supplier Footprint: SMD2016-4P; JLCPCB Part Class: Extended Part; Datasheet: https://item.szlcsc.com/datasheet/XTM20040000FT00351001/39361267.html; Supplier: LCSC; Type: Crystal Oscillator; Normal temperature Frequency Tolerance: ±10ppm; Load Capacitance: 9pF; Frequency Stability: ±10ppm; Equivalent Series Resistance(ESR): 40Ω; Operating Temperature: -20℃~+70℃

## Nets
1V8: U33.E8(VCCBATT_0) U33.H10(VCCADC_0) ; also on sheet 1 8
3V3: C67.2 C68.2 C69.2 C70.2 C72.2 C74.2 C75.2 C78.2 C171.2 C175.2 C319.2 C367.2 C368.2 C371.2 C372.2 C373.2 C374.2 C375.2 C376.2 C377.2 C378.1 C380.2 J19.1 L5.1 Q6.1(G) Q7.1(G) Q8.1(G) Q9.1(G) Q10.1(G) Q11.1(G) Q12.1(G) Q13.1(G) Q14.1(G) R54.2 R163.1 R166.2 R168.2 R169.2 R176.2 R177.2 R178.1 R180.1 R181.1 R182.1 R183.1 R184.1 R185.1 R186.1 R187.1 R188.1 R433.2 R440.1 R441.1 R442.1 R443.2 R444.2 R540.2 R545.2 R546.2 R547.2 R548.2 R549.2 R551.2 R552.2 R553.2 R556.2 R558.2 R560.2 R562.2 R564.2 R566.2 R568.2 R570.2 R572.2 RN1.5 RN1.6 RN1.7 RN1.8 RN2.5 RN2.6 RN2.7 RN2.8 SD1.4(VDD) SW4.3 SW16.1 SW17.1 U4.12(CE2) U4.37(Vcc) U4.47(BYTE#) U8.1(DIR) U8.20(VCC) U16.8(GPIO3) U16.20(VDD3P3_RTC) U16.46(VDD3P3_CPU) U16.55(VDDA) U16.56(VDDA) U27.8(VCC) U32.3(VPHY) U32.8(VPLL) U32.12(VCCIO) U32.24(VCCIO) U32.39(VCCD) U32.46(VCCIO) U33.P8(CFGBVS_0) U49.6(ORG) U49.8(VCC) X7.4(VDD) ; also on sheet 1 4 5 6 7 8
5V: C320.2 C369.2 C370.2 R468.1 R557.1 R559.1 R561.1 R563.1 R565.1 R567.1 R569.1 R571.1 R573.1 U7.1(DIR) U7.20(VCC) U32.40(VREGIN) ; also on sheet 1 4 5 6 7
GND: C67.1 C68.1 C69.1 C70.1 C71.1 C72.1 C74.1 C75.1 C76.1 C77.1 C78.1 C79.1 C80.1 C81.2 C82.1 C171.1 C172.1 C175.1 C308.2 C319.1 C320.1 C365.2 C366.2 C367.1 C368.1 C369.1 C370.1 C371.1 C372.1 C373.1 C374.1 C375.1 C376.1 C377.1 C378.2 C379.1 C380.1 J1.1 J1.2 J1.4 J1.9 J1.10 J1.14 J1.20 J1.24 J1.26 J1.27 J2.15 J19.2 LED2.1(C) LED6.1(K) R164.1 R165.2 R179.1 R544.2 SD1.6(VSS) SD1.10(GND) SD1.11(GND) SD1.12(GND) SD1.13(GND) SW3.1 SW4.1 SW16.3 SW17.3 SW24.3 SW25.1 U4.27(VSS) U4.46(Vss) U7.10(GND) U7.19(OE#) U8.10(GND) U8.19(OE#) U16.22(XTAL_32K_N) U16.51(GPIO45) U16.57(EP) U27.4(GND) U32.4(AGND) U32.9(AGND) U32.10(GND) U32.11(GND) U32.22(GND) U32.23(GND) U32.35(GND) U32.36(GND) U32.41(AGND) U32.42(TEST) U32.47(GND) U32.48(GND) U32.49(EP) U33.H9(GNDADC_0) U33.J9(VREFN_0) U33.J10(VP_0) U33.K9(VN_0) U33.K10(VREFP_0) U49.5(GND) U49.7(NC) X3.2(GND) X3.4(GND) X7.2(GND) ; also on sheet 1 4 5 6 7 8
/BSY_ESPROFILE: J2.10 RN1.2 U16.24(GPIO18) ; also on sheet 8
/BSY_EXT: U8.18(B1) ; also on sheet 8
/BSY_EXT_5V: J1.16 U8.2(A1)
/CE_SRAM: U4.26(CE1#) ; also on sheet 8
/CMD_ESPROFILE: J2.9 RN1.1 U16.23(GPIO17) ; also on sheet 8
/CMD_EXT: U7.9(A7) ; also on sheet 8
/CMD_EXT_5V: J1.17 U7.11(B7)
/LDS_SRAM: U4.15(BLE#) ; also on sheet 8
/OE_SRAM: U4.28(OE#) ; also on sheet 8
/PARITY_ESPROFILE: J2.14 RN2.1 U16.39(GPIO34) ; also on sheet 8
/PARITY_EXT: U8.17(B2) ; also on sheet 8
/PARITY_EXT_5V: J1.18 U8.3(A2)
/PRES_ESPROFILE: J2.13 RN2.2 U16.40(GPIO35) ; also on sheet 8
/PRES_EXT: Q14.2(S) R572.1 ; also on sheet 8
/PRES_EXT_5V: J1.21 Q14.3(D) R573.2
/STRB_ESPROFILE: J2.12 RN1.4 U16.38(GPIO33) ; also on sheet 8
/STRB_EXT: U7.7(A5) ; also on sheet 8
/STRB_EXT_5V: J1.15 U7.13(B5)
/UDS_SRAM: U4.14(BHE#) ; also on sheet 8
/WE_SRAM: U4.11(WE#) ; also on sheet 8
/WRQ_EXT: U7.6(A4) ; also on sheet 8
/WRQ_EXT_5V: U7.14(B4) ; also on sheet 4
A1_SRAM: U4.25(A0) ; also on sheet 8
A2_SRAM: U4.24(A1) ; also on sheet 8
A3_SRAM: U4.23(A2) ; also on sheet 8
A4_SRAM: U4.22(A3) ; also on sheet 8
A5_SRAM: U4.21(A4) ; also on sheet 8
A6_SRAM: U4.20(A5) ; also on sheet 8
A7_SRAM: U4.19(A6) ; also on sheet 8
A8_SRAM: U4.18(A7) ; also on sheet 8
A9_SRAM: U4.8(A8) ; also on sheet 8
A10_SRAM: U4.7(A9) ; also on sheet 8
A11_SRAM: U4.6(A10) ; also on sheet 8
A12_SRAM: U4.5(A11) ; also on sheet 8
A13_SRAM: U4.4(A12) ; also on sheet 8
A14_SRAM: U4.3(A13) ; also on sheet 8
A15_SRAM: U4.2(A14) ; also on sheet 8
A16_SRAM: U4.1(A15) ; also on sheet 8
A17_SRAM: U4.48(A16) ; also on sheet 8
A18_SRAM: U4.17(A17) ; also on sheet 8
A19_SRAM: U4.16(A18) ; also on sheet 8
A20_SRAM: U4.9(A19) ; also on sheet 8
B_ESPROFILE: R507.2 U16.52(GPIO46)
BOOT_ESPROFILE: C308.1 R433.1 SW25.2 U16.5(GPIO0)
CFG_CS: R176.1 U27.1(CS#) ; also on sheet 8
CFG_DQ0: R172.2 ; also on sheet 8
CFG_DQ1: R174.1 ; also on sheet 8
CFG_DQ2: R173.1 ; also on sheet 8
CFG_DQ3: R175.2 ; also on sheet 8
CFG_SCK: R179.2 R180.2 U27.6(CLK) U33.E9(CCLK_0)
D0_SRAM: U4.29(I/O0) ; also on sheet 8
D1_SRAM: U4.31(I/O1) ; also on sheet 8
D2_SRAM: U4.33(I/O2) ; also on sheet 8
D3_SRAM: U4.35(I/O3) ; also on sheet 8
D4_SRAM: U4.38(I/O4) ; also on sheet 8
D5_SRAM: U4.40(I/O5) ; also on sheet 8
D6_SRAM: U4.42(I/O6) ; also on sheet 8
D7_SRAM: U4.44(I/O7) ; also on sheet 8
D8_SRAM: U4.30(I/O8) ; also on sheet 8
D9_SRAM: U4.32(I/O9) ; also on sheet 8
D10_SRAM: U4.34(I/O10) ; also on sheet 8
D11_SRAM: U4.36(I/O11) ; also on sheet 8
D12_SRAM: U4.39(I/O12) ; also on sheet 8
D13_SRAM: U4.41(I/O13) ; also on sheet 8
D14_SRAM: U4.43(I/O14) ; also on sheet 8
D15_SRAM: U4.45(I/O15/A20) ; also on sheet 8
EECLK: R553.1 U32.44(EECLK) U49.2(SK)
EECS: R552.1 U32.45(EECS) U49.1(CS)
EEDATA: R550.1 U32.43(EEDATA) U49.3(DI)
EN_ESPROFILE: C81.1 C82.2 R54.1 SW3.3 U16.4(CHIP_PU)
ESPROFILE_DN: R53.1 ; also on sheet 1
ESPROFILE_DP: R52.1 ; also on sheet 1
FPGA_0_ESPROFILE: U16.41(GPIO36) ; also on sheet 8
FPGA_1_ESPROFILE: U16.42(GPIO37) ; also on sheet 8
FPGA_2_ESPROFILE: U16.43(GPIO38) ; also on sheet 8
G_ESPROFILE: R508.2 U16.6(GPIO1)
HDD_SRC: SW4.2 ; also on sheet 8
JTAG_DN: U32.6(DM) ; also on sheet 1
JTAG_DP: U32.7(DP) ; also on sheet 1
M3_5V: J1.25 ; also on sheet 7
OCD_EXT: U8.16(B3) ; also on sheet 8
OCD_EXT_5V: J1.19 R468.2 U8.4(A3)
PD0_ESPROFILE: J2.1 R181.2 U16.9(GPIO4) ; also on sheet 8
PD0_EXT: Q6.2(S) R556.1 ; also on sheet 8
PD0_EXT_5V: J1.5 Q6.3(D) R557.2
PD1_ESPROFILE: J2.2 R182.2 U16.10(GPIO5) ; also on sheet 8
PD1_EXT: Q7.2(S) R558.1 ; also on sheet 8
PD1_EXT_5V: J1.6 Q7.3(D) R559.2
PD2_ESPROFILE: J2.3 R183.2 U16.11(GPIO6) ; also on sheet 8
PD2_EXT: Q8.2(S) R560.1 ; also on sheet 8
PD2_EXT_5V: J1.8 Q8.3(D) R561.2
PD3_ESPROFILE: J2.4 R184.2 U16.12(GPIO7) ; also on sheet 8
PD3_EXT: Q9.2(S) R562.1 ; also on sheet 8
PD3_EXT_5V: J1.22 Q9.3(D) R563.2
PD4_ESPROFILE: J2.5 R185.2 U16.13(GPIO8) ; also on sheet 8
PD4_EXT: Q10.2(S) R564.1 ; also on sheet 8
PD4_EXT_5V: J1.23 Q10.3(D) R565.2
PD5_ESPROFILE: J2.6 R186.2 U16.14(GPIO9) ; also on sheet 8
PD5_EXT: Q11.2(S) R566.1 ; also on sheet 8
PD5_EXT_5V: J1.11 Q11.3(D) R567.2
PD6_ESPROFILE: J2.7 R187.2 U16.15(GPIO10) ; also on sheet 8
PD6_EXT: Q12.2(S) R568.1 ; also on sheet 8
PD6_EXT_5V: J1.12 Q12.3(D) R569.2
PD7_ESPROFILE: J2.8 R188.2 U16.16(GPIO11) ; also on sheet 8
PD7_EXT: Q13.2(S) R570.1 ; also on sheet 8
PD7_EXT_5V: J1.13 Q13.3(D) R571.2
PH0_EXT: U7.2(A0) ; also on sheet 8
PH0_EXT_5V: U7.18(B0) ; also on sheet 4
PH1_EXT: U7.3(A1) ; also on sheet 8
PH1_EXT_5V: U7.17(B1) ; also on sheet 4
PH2_EXT: U7.4(A2) ; also on sheet 8
PH2_EXT_5V: U7.16(B2) ; also on sheet 4
PH3_EXT: U7.5(A3) ; also on sheet 8
PH3_EXT_5V: U7.15(B3) ; also on sheet 4
R/W_ESPROFILE: J2.11 RN1.3 U16.27(GPIO21) ; also on sheet 8
R/W_EXT: U7.8(A6) ; also on sheet 8
R/W_EXT_5V: J1.3 U7.12(B6)
R_ESPROFILE: R509.2 U16.7(GPIO2)
RAM_SEL_0: SW17.2 ; also on sheet 8
RAM_SEL_1: SW16.2 ; also on sheet 8
RDA_EXT: U8.15(B4) ; also on sheet 8
RDA_EXT_5V: U8.5(A4) ; also on sheet 4
SDIO_CLK_ESPROFILE: SD1.5(CLK(SCLK)) U16.45(MTDO)
SDIO_CMD_ESPROFILE: R444.1 SD1.3(CMD(DI)) U16.44(MTCK)
SDIO_D0_ESPROFILE: R442.2 SD1.7(DAT0(D0)) U16.17(GPIO12)
SDIO_D1_ESPROFILE: R441.2 SD1.8(DAT1(RSV)) U16.18(GPIO13)
SDIO_D2_ESPROFILE: R440.2 SD1.1(DAT2(RSV)) U16.19(GPIO14)
SDIO_D3_ESPROFILE: R443.1 SD1.2(CDDAT3(CS)) U16.21(XTAL_32K_P)
SNS_EXT: U8.14(B5) ; also on sheet 8
SNS_EXT_5V: U8.6(A5) ; also on sheet 4
TCK: R161.2 R545.1 U32.13(ADBUS0) U33.E10(TCK_0)
TDI: R159.2 R546.1 U32.14(ADBUS1) U33.E11(TDI_0)
TDO: R160.2 R547.1 U32.15(ADBUS2) U33.E13(TDO_0)
TMS: R158.2 R548.1 U32.16(ADBUS3) U33.E12(TMS_0)
$2N54127: R174.2 U27.2(DO(IO1))
$2N54128: R173.2 R178.2 U27.3(WP#(IO2))
$2N54139: LED6.2(A) R506.2
$2N54148: R175.1 R177.1 U27.7(HOLD#orRESET#(IO3))
$2N54149: R172.1 U27.5(DI(IO0))
$2N54156: R164.2 U33.P13(M1_0)
$2N54157: C172.2 R169.1 U33.P7(INIT_B_0)
$2N54159: SW24.2 U33.P9(PROGRAM_B_0)
$2N54160: R163.2 U33.P12(M0_0)
$2N54161: J20.1 R165.1
$2N54162: J20.2 U33.P11(M2_0)
$2N54163: J20.3 R166.1
$2N54486: J19.4 R160.1
$2N54487: J19.3 R161.1
$2N54488: J19.5 R159.1
$2N54489: J19.6 R158.1
$2N56343: R168.1 SW24.1
$2N61601: R506.1 R540.1 U33.P10(DONE_0)
$2N63209: C365.1 U32.38(VCCCORE)
$2N63211: C366.1 U32.37(VCCA)
$2N63241: R544.1 U32.5(REF)
$2N63270: C379.2 R549.1 U32.34(#RESET)
$2N63313: U32.1(XCSI) X7.3(OUT)
$2N63334: R550.2 R551.1 U49.4(DO)
$3N47776: R52.2 U16.26(GPIO20)
$3N47804: C71.2 L5.2 U16.2(VDD3P3) U16.3(VDD3P3)
$3N47806: R53.2 U16.25(GPIO19)
$3N47814: C80.2 U16.53(XTAL_N) X3.3
$3N47819: C79.2 L6.2 X3.1
$3N47823: L6.1 U16.54(XTAL_P)
$3N47832: C76.2 C77.2 U16.29(VDD_SPI)
$3N65572: LED2.2(B) R507.1
$3N65578: LED2.3(G) R508.1
$3N65585: LED2.4(R) R509.1

Not connected (* = marked no-connect by the designer): J1 7*; R506 3*; R507 3*; R508 3*; R509 3*; RN2 3* 4*; SD1 9(CD)*; SW3 2* 4*; SW24 4*; U4 10(NC)* 13(DNU)*; U8 7(A6)* 8(A7)* 9(A8)* 11(B8)* 12(B7)* 13(B6)*; U16 1(LNA_IN)* 28(SPICS1)* 30(SPIHD)* 31(SPIWP)* 32(SPICS0)* 33(SPICLK)* 34(SPIQ)* 35(SPID)* 36(SPICLK_N)* 37(SPICLK_P)* 47(MTDI)* 48(MTMS)* 49(U0TXD)* 50(U0RXD)*; U32 2(XCSO)* 17(ADBUS4)* 18(ADBUS5)* 19(ADBUS6)* 20(ADBUS7)* 21(ACBUS0)* 25(ACBUS1)* 26(ACBUS2)* 27(ACBUS3)* 28(ACBUS4)* 29(ACBUS5)* 30(ACBUS6)* 31(ACBUS7)* 32(ACBUS8)* 33(ACBUS9)*; U33 L9(DXN_0)* L10(DXP_0)*; X7 1(OE/NC)*

## Notes on the sheets
sheet 2
- FT232 USB to JTAG
- FPGA Programming/Config Interface
- Bitstream Source
- SPI Flash         JTAG
- Done Programming
- PROGRAM
  (Manual Override)
- Bitstream SPI Flash
- FT232 Config EEPROM
- Dedicated JTAG Header
sheet 3
- ESProFile ProFile Emulator
- ESProFile SD Card
- ESProFile Bus Pullups
- ESProFile Debug Header
- ESP32-S3
- Hard-wire for emul mode.
- And drive always connected!
- ESProFile Reset Circuit
- ESProFile BOOT Button
- ESProFile Status LED
- ESProFile
- External
- External ProFile Connection
- Lisa System Memory
- Hard Drive Source
- Bidirectional Level Shifters
- Unidirectional 3.3V -> 5V Shifters
- We throw in a few floppy signals too...
- External ProFile Port
- Unidirectional 5V -> 3.3V Shifters
- We throw in a few floppy signals too...
- RAM Size - MSB
- RAM Size - LSB
